# EAGLE schematic eib (EAGLE 6.4)
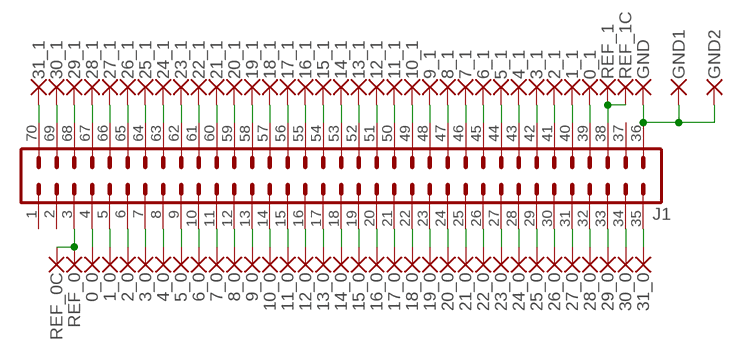
[diagram p0: schematic, sheet 1]

## Parts
0_0  PAD_20_37  [PAD_20_37]
0_1  PAD_20_37  [PAD_20_37]
1_0  PAD_20_37  [PAD_20_37]
1_1  PAD_20_37  [PAD_20_37]
2_0  PAD_20_37  [PAD_20_37]
2_1  PAD_20_37  [PAD_20_37]
3_0  PAD_20_37  [PAD_20_37]
3_1  PAD_20_37  [PAD_20_37]
4_0  PAD_20_37  [PAD_20_37]
4_1  PAD_20_37  [PAD_20_37]
5_0  PAD_20_37  [PAD_20_37]
5_1  PAD_20_37  [PAD_20_37]
6_0  PAD_20_37  [PAD_20_37]
6_1  PAD_20_37  [PAD_20_37]
7_0  PAD_20_37  [PAD_20_37]
7_1  PAD_20_37  [PAD_20_37]
8_0  PAD_20_37  [PAD_20_37]
8_1  PAD_20_37  [PAD_20_37]
9_0  PAD_20_37  [PAD_20_37]
9_1  PAD_20_37  [PAD_20_37]
10_0  PAD_20_37  [PAD_20_37]
10_1  PAD_20_37  [PAD_20_37]
11_0  PAD_20_37  [PAD_20_37]
11_1  PAD_20_37  [PAD_20_37]
12_0  PAD_20_37  [PAD_20_37]
12_1  PAD_20_37  [PAD_20_37]
13_0  PAD_20_37  [PAD_20_37]
13_1  PAD_20_37  [PAD_20_37]
14_0  PAD_20_37  [PAD_20_37]
14_1  PAD_20_37  [PAD_20_37]
15_0  PAD_20_37  [PAD_20_37]
15_1  PAD_20_37  [PAD_20_37]
16_0  PAD_20_37  [PAD_20_37]
16_1  PAD_20_37  [PAD_20_37]
17_0  PAD_20_37  [PAD_20_37]
17_1  PAD_20_37  [PAD_20_37]
18_0  PAD_20_37  [PAD_20_37]
18_1  PAD_20_37  [PAD_20_37]
19_0  PAD_20_37  [PAD_20_37]
19_1  PAD_20_37  [PAD_20_37]
20_0  PAD_20_37  [PAD_20_37]
20_1  PAD_20_37  [PAD_20_37]
21_0  PAD_20_37  [PAD_20_37]
21_1  PAD_20_37  [PAD_20_37]
22_0  PAD_20_37  [PAD_20_37]
22_1  PAD_20_37  [PAD_20_37]
23_0  PAD_20_37  [PAD_20_37]
23_1  PAD_20_37  [PAD_20_37]
24_0  PAD_20_37  [PAD_20_37]
24_1  PAD_20_37  [PAD_20_37]
25_0  PAD_20_37  [PAD_20_37]
25_1  PAD_20_37  [PAD_20_37]
26_0  PAD_20_37  [PAD_20_37]
26_1  PAD_20_37  [PAD_20_37]
27_0  PAD_20_37  [PAD_20_37]
27_1  PAD_20_37  [PAD_20_37]
28_0  PAD_20_37  [PAD_20_37]
28_1  PAD_20_37  [PAD_20_37]
29_0  PAD_20_37  [PAD_20_37]
29_1  PAD_20_37  [PAD_20_37]
30_0  PAD_20_37  [PAD_20_37]
30_1  PAD_20_37  [PAD_20_37]
31_0  PAD_20_37  [PAD_20_37]
31_1  PAD_20_37  [PAD_20_37]
GND  PAD_20_37  [PAD_20_37]
GND1  PAD_20_37  [PAD_20_37]
GND2  PAD_20_37  [PAD_20_37]
J1  HIROSE_DF40-70DS  [HIROSE_DF40C-70DS]
REF_0  PAD_20_37  [PAD_20_37]
REF_0C  PAD_20_37  [PAD_20_37]
REF_1  PAD_20_37  [PAD_20_37]
REF_1C  PAD_20_37  [PAD_20_37]

## Nets
N$1: 0_0.1(P) J1.4
N$2: 1_0.1(P) J1.5
N$3: 2_0.1(P) J1.6
N$4: 3_0.1(P) J1.7
N$5: 4_0.1(P) J1.8
N$6: 5_0.1(P) J1.9
N$7: 6_0.1(P) J1.10
N$8: 7_0.1(P) J1.11
N$9: 8_0.1(P) J1.12
N$10: 9_0.1(P) J1.13
N$11: 10_0.1(P) J1.14
N$12: 11_0.1(P) J1.15
N$13: 12_0.1(P) J1.16
N$14: 13_0.1(P) J1.17
N$15: 14_0.1(P) J1.18
N$16: 15_0.1(P) J1.19
N$17: 16_0.1(P) J1.20
N$18: 17_0.1(P) J1.21
N$19: 18_0.1(P) J1.22
N$20: 19_0.1(P) J1.23
N$21: 20_0.1(P) J1.24
N$22: 21_0.1(P) J1.25
N$23: 22_0.1(P) J1.26
N$24: 23_0.1(P) J1.27
N$25: 24_0.1(P) J1.28
N$26: 25_0.1(P) J1.29
N$27: 26_0.1(P) J1.30
N$28: 27_0.1(P) J1.31
N$29: 28_0.1(P) J1.32
N$30: 29_0.1(P) J1.33
N$31: 30_0.1(P) J1.34
N$32: 31_0.1(P) J1.35
N$33: 0_1.1(P) J1.39
N$34: 1_1.1(P) J1.40
N$35: 2_1.1(P) J1.41
N$36: 3_1.1(P) J1.42
N$37: 4_1.1(P) J1.43
N$38: 5_1.1(P) J1.44
N$39: 6_1.1(P) J1.45
N$40: 7_1.1(P) J1.46
N$41: 8_1.1(P) J1.47
N$42: 9_1.1(P) J1.48
N$43: 10_1.1(P) J1.49
N$44: 11_1.1(P) J1.50
N$45: 12_1.1(P) J1.51
N$46: 13_1.1(P) J1.52
N$47: 14_1.1(P) J1.53
N$48: 15_1.1(P) J1.54
N$49: 16_1.1(P) J1.55
N$50: 17_1.1(P) J1.56
N$51: 18_1.1(P) J1.57
N$52: 19_1.1(P) J1.58
N$53: 20_1.1(P) J1.59
N$54: 21_1.1(P) J1.60
N$55: 22_1.1(P) J1.61
N$56: 23_1.1(P) J1.62
N$57: 24_1.1(P) J1.63
N$58: 25_1.1(P) J1.64
N$59: 26_1.1(P) J1.65
N$60: 27_1.1(P) J1.66
N$61: 28_1.1(P) J1.67
N$62: 29_1.1(P) J1.68
N$63: 30_1.1(P) J1.69
N$64: 31_1.1(P) J1.70
N$65: J1.3 REF_0.1(P) REF_0C.1(P)
N$66: J1.38 REF_1.1(P) REF_1C.1(P)
N$67: GND1.1(P) GND2.1(P) GND.1(P) J1.36
Unconnected: J1.1 J1.2 J1.37

## Library data of the parts
0_0 0_1 1_0 1_1 2_0 2_1 3_0 3_1 4_0 4_1 5_0 5_1 6_0 6_1 7_0 7_1 8_0 8_1 9_0 9_1 10_0 10_1 11_0 11_1 12_0 12_1 13_0 13_1 14_0 14_1 15_0 15_1 16_0 16_1 17_0 17_1 18_0 18_1 19_0 19_1 20_0 20_1 21_0 21_1 22_0 22_1 23_0 23_1 24_0 24_1 25_0 25_1 26_0 26_1 27_0 27_1 28_0 28_1 29_0 29_1 30_0 30_1 31_0 31_1 GND GND1 GND2 REF_0 REF_0C REF_1 REF_1C = rpoddar:PAD_20_37
J1 = rpoddar:HIROSE_DF40-70DS